# EasyEDA schematic 1-Schematic_PCIe riser to internal USB3.json

## Sheets
1 Sheet_2: TITLE: Sheet_2; REV: 1.0; Date: 2020-04-07; Sheet: 1/1; Drawn By: lfdla; Company: Your Company
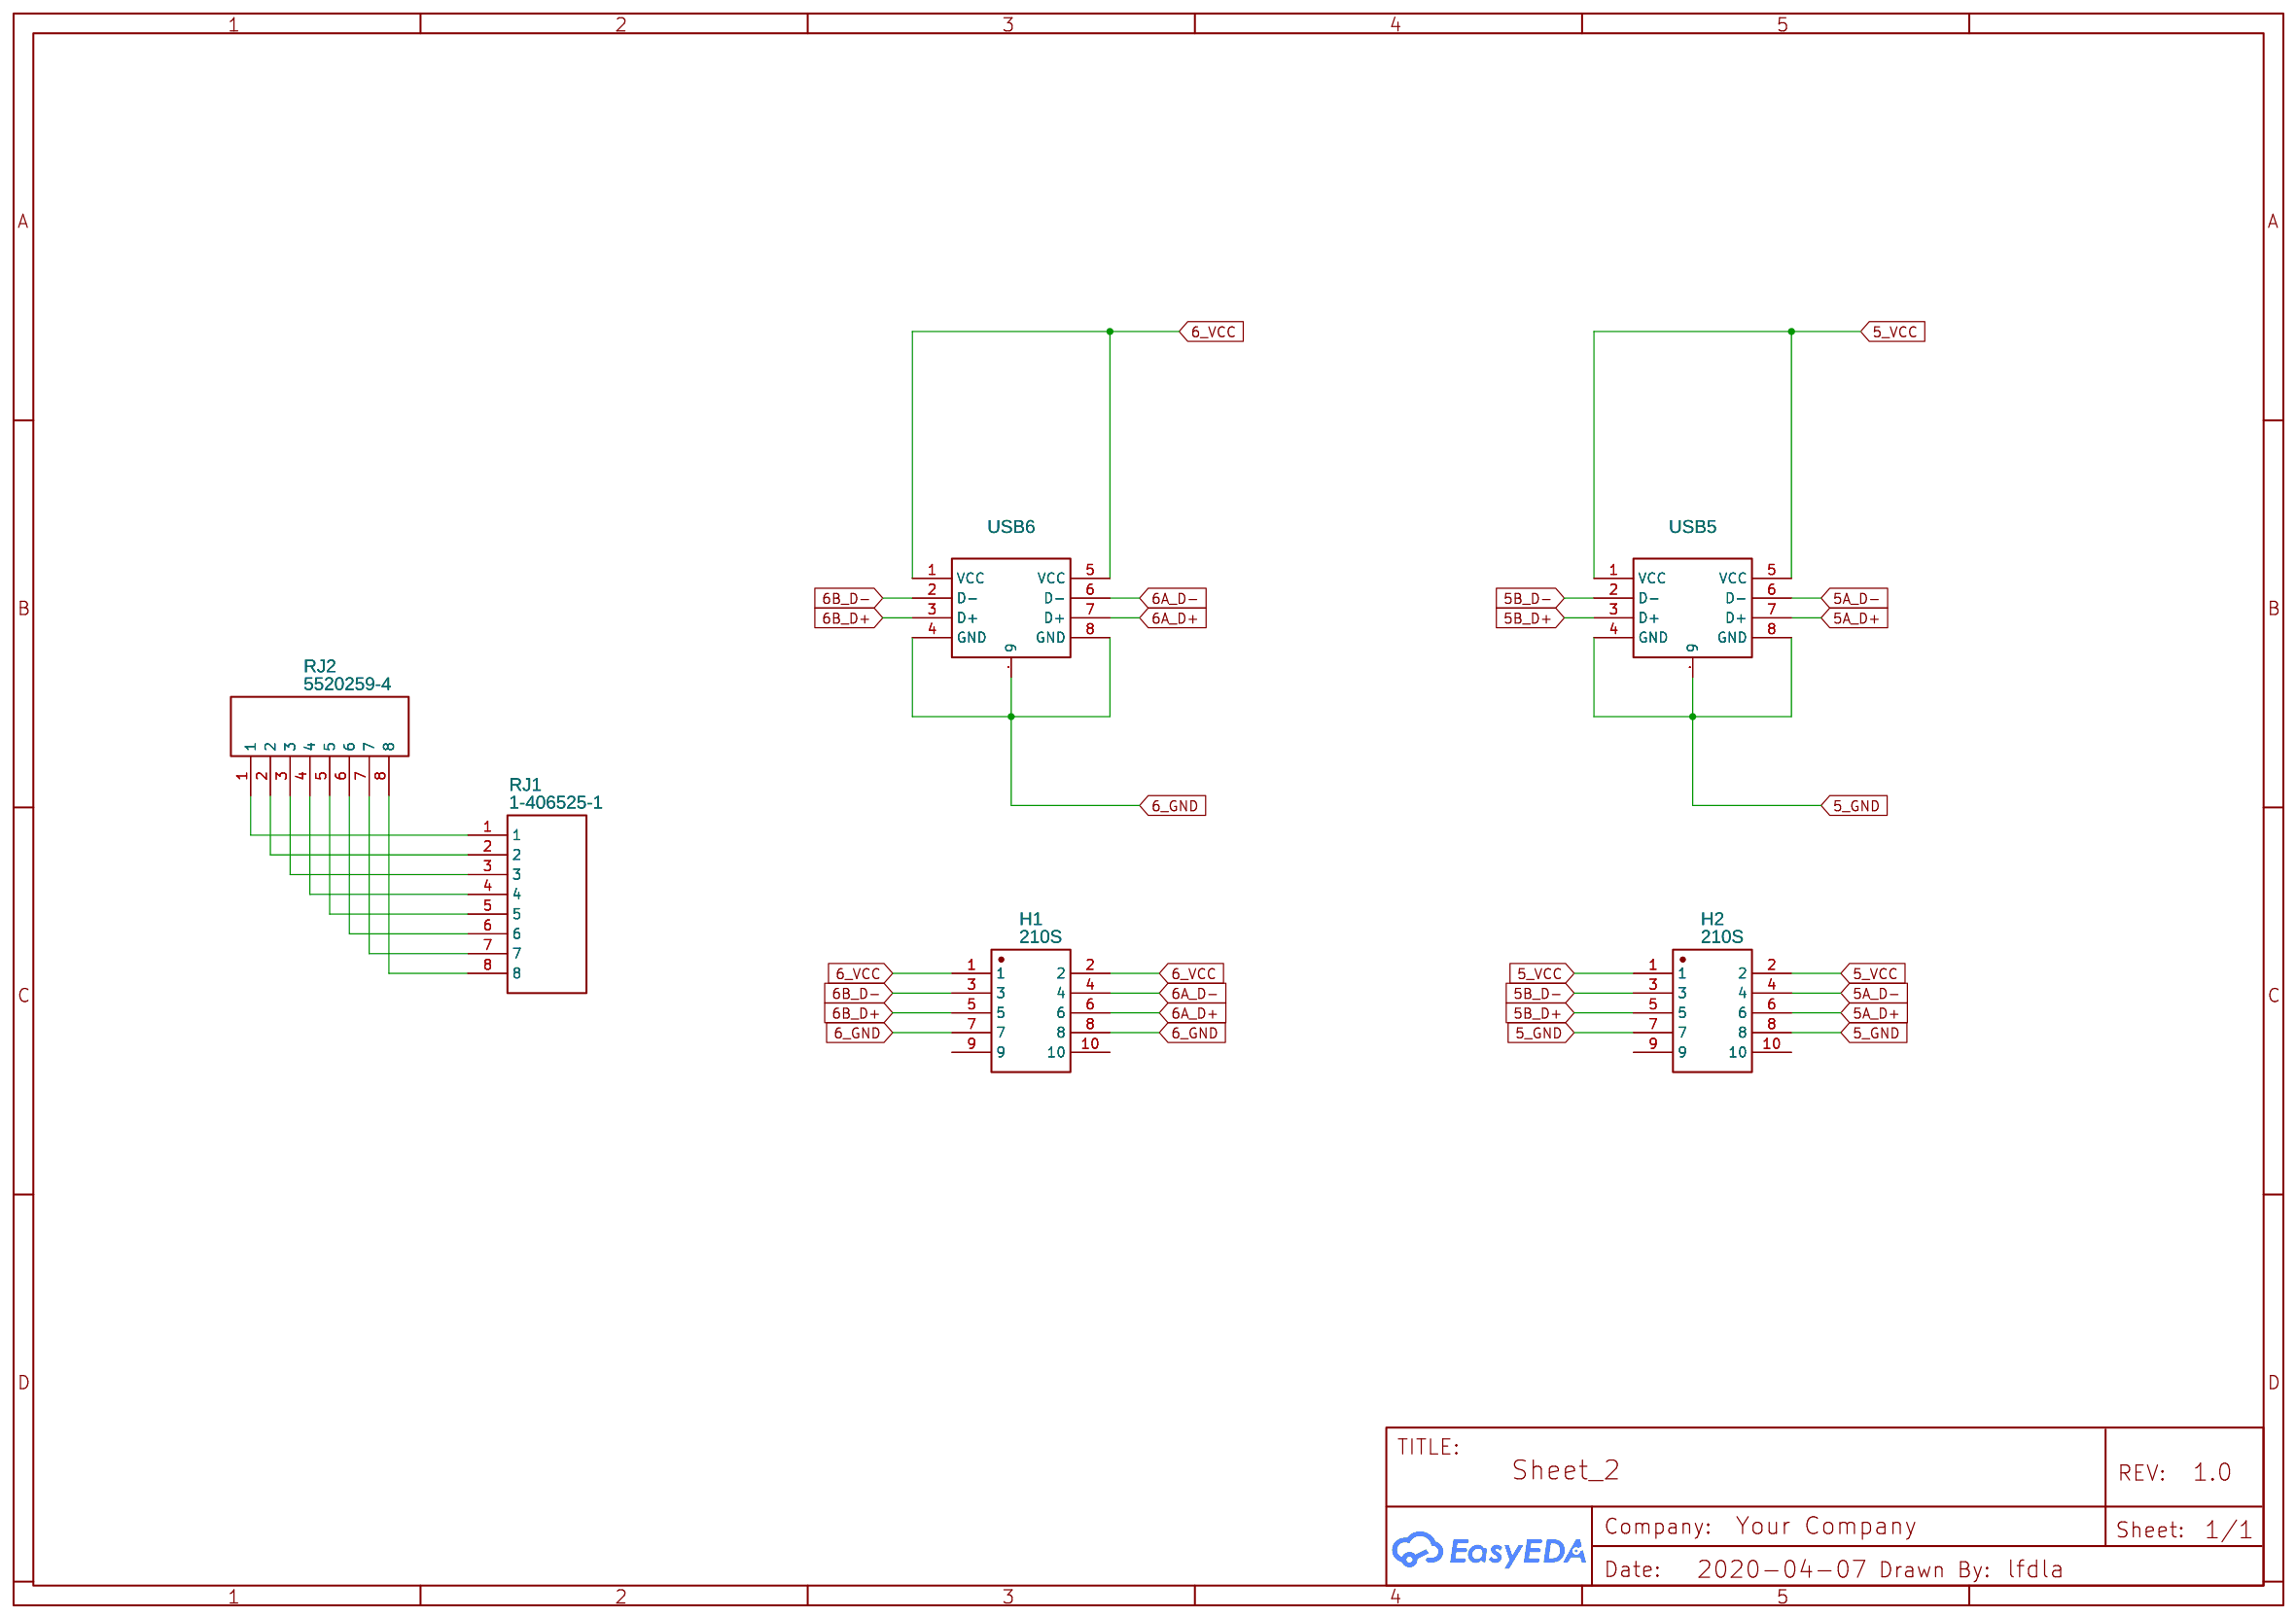
[diagram p0: Sheet_2]
2 Sheet_1: TITLE: Sheet_1; Date: 2020-04-05
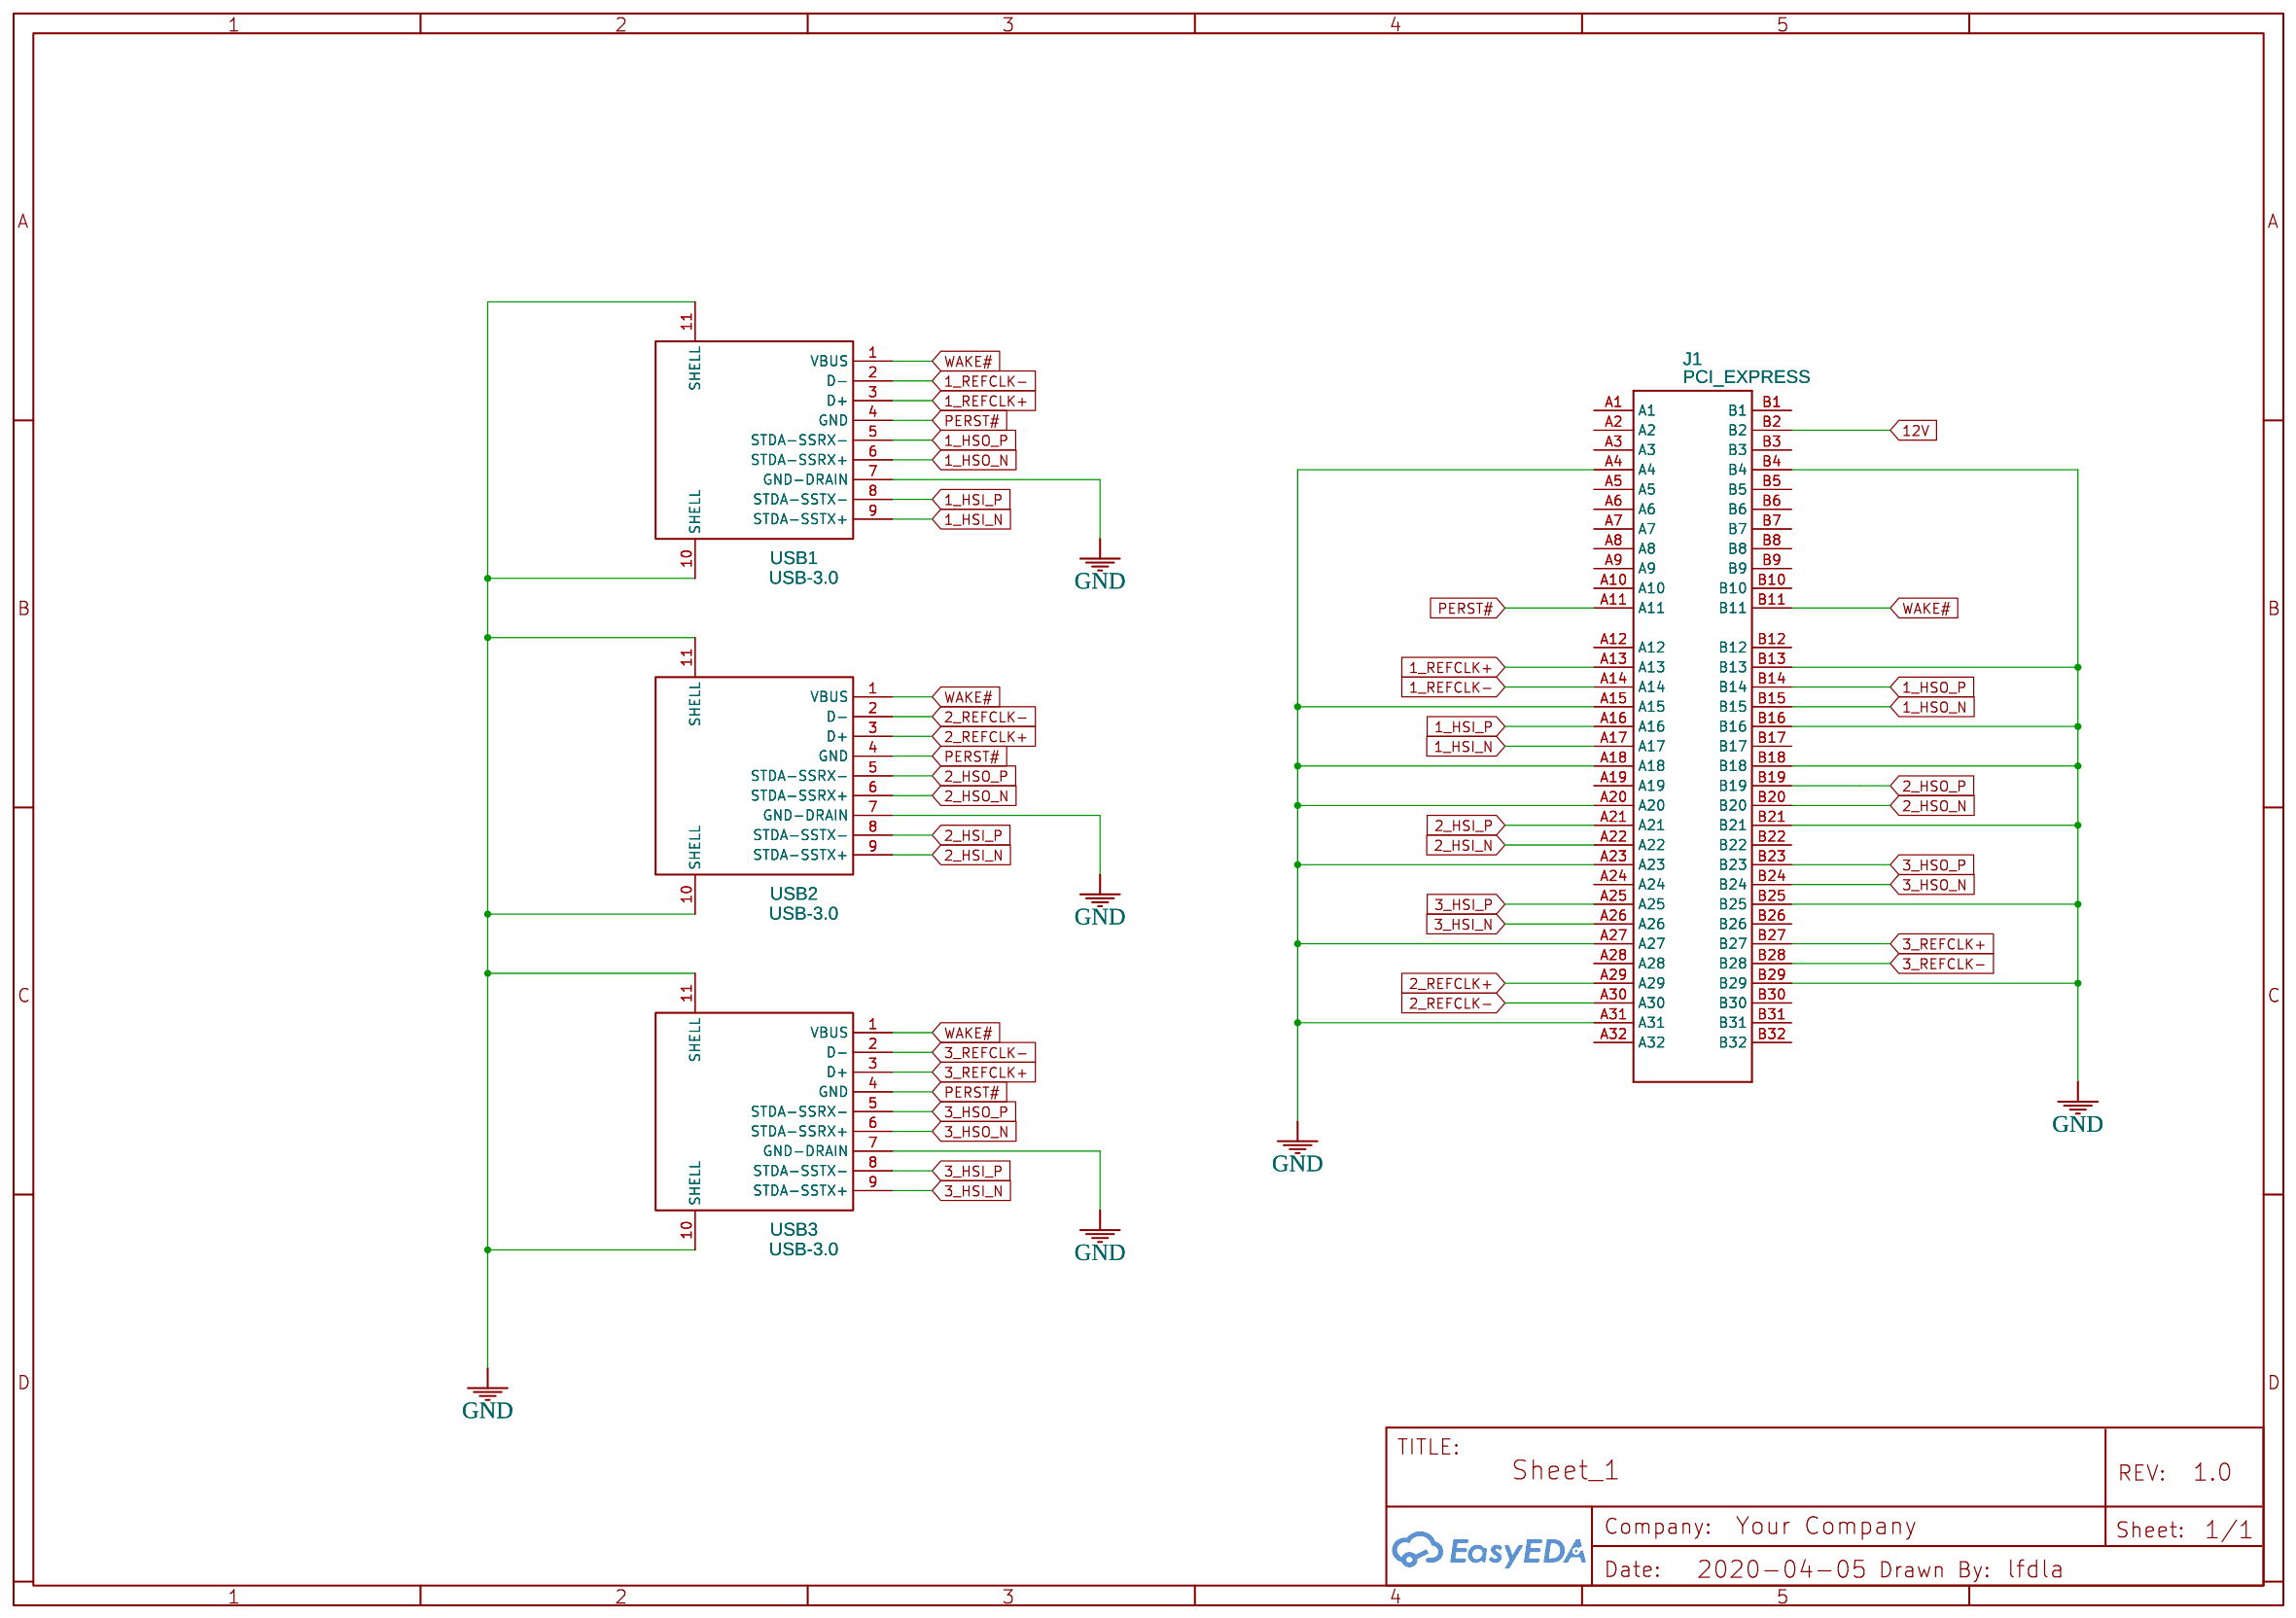
[diagram p1: Sheet_1]

## Parts
sheet Sheet_1
J1  PCI_EXPRESS  [PCIEX4]
USB1  USB-3.0  [USB-3.0-TH_C69073]
USB2  USB-3.0  [USB-3.0-TH_C69073]
USB3  USB-3.0  [USB-3.0-TH_C69073]
sheet Sheet_2
H1  210S  [HDR-TH_10P-P2.54-V-R2-C5-S2.54_MTP125-1205S1]
H2  210S  [HDR-TH_10P-P2.54-V-R2-C5-S2.54_MTP125-1205S1]
RJ1  1-406525-1  [RJ45-TH_1-406525-1]
RJ2  5520259-4  [RJ45-TH_5520259-4]
USB5  Double layer DIP 90° white  [USB-A-TH_USB-M-51]
USB6  Double layer DIP 90° white  [USB-A-TH_USB-M-51]

## Library data of the parts
J1 = PCI_EXPRESS_32PIN_MALE_PCB: Manufacturer Part: PCI_EXPRESS_PCB; Supplier Part: undefined; Contributor: Eduardo Solis
USB1-USB3 = USB-3.0-AF-90-16.5X12.5-H6.95: Supplier: LCSC; Supplier Part: C69073; Manufacturer: LCSC; Contributor: LCSC
H1 H2 = 210S-2*5P L=11.6MMGold-plated black: Supplier: LCSC; Manufacturer: Ckmtw; Contributor: LCSC; Supplier Part: C124387
RJ1 = 1-406525-1: Supplier: LCSC; Supplier Part: C125066; Manufacturer: TE Connectivity; Contributor: LCSC
RJ2 = 5520259-4: Supplier: LCSC; Manufacturer: TE Connectivity; Supplier Part: C86491
USB5 USB6 = Double layer DIP 90° white: Supplier: LCSC; Manufacturer: ValuePro; Supplier Part: C2341

## Nets
12V: J1.B2
GND: J1.A4 J1.A15 J1.A18 J1.A20 J1.A23 J1.A27 J1.A31 J1.B4 J1.B13 J1.B16 J1.B18 J1.B21 J1.B25 J1.B29 USB1.7(GND-DRAIN) USB1.10(SHELL) USB1.11(SHELL) USB2.7(GND-DRAIN) USB2.10(SHELL) USB2.11(SHELL) USB3.7(GND-DRAIN) USB3.10(SHELL) USB3.11(SHELL)
1_HSI_N: J1.A17 USB1.9(STDA-SSTX+)
1_HSI_P: J1.A16 USB1.8(STDA-SSTX-)
1_HSO_N: J1.B15 USB1.6(STDA-SSRX+)
1_HSO_P: J1.B14 USB1.5(STDA-SSRX-)
1_REFCLK+: J1.A13 USB1.3(D+)
1_REFCLK-: J1.A14 USB1.2(D-)
2_HSI_N: J1.A22 USB2.9(STDA-SSTX+)
2_HSI_P: J1.A21 USB2.8(STDA-SSTX-)
2_HSO_N: J1.B20 USB2.6(STDA-SSRX+)
2_HSO_P: J1.B19 USB2.5(STDA-SSRX-)
2_REFCLK+: J1.A29 USB2.3(D+)
2_REFCLK-: J1.A30 USB2.2(D-)
3_HSI_N: J1.A26 USB3.9(STDA-SSTX+)
3_HSI_P: J1.A25 USB3.8(STDA-SSTX-)
3_HSO_N: J1.B24 USB3.6(STDA-SSRX+)
3_HSO_P: J1.B23 USB3.5(STDA-SSRX-)
3_REFCLK+: J1.B27 USB3.3(D+)
3_REFCLK-: J1.B28 USB3.2(D-)
5_GND: H2.7 H2.8 USB5.4(GND) USB5.8(GND) USB5.9
5_VCC: H2.1 H2.2 USB5.1(VCC) USB5.5(VCC)
5A_D+: H2.6 USB5.7(D+)
5A_D-: H2.4 USB5.6(D-)
5B_D+: H2.5 USB5.3(D+)
5B_D-: H2.3 USB5.2(D-)
6_GND: H1.7 H1.8 USB6.4(GND) USB6.8(GND) USB6.9
6_VCC: H1.1 H1.2 USB6.1(VCC) USB6.5(VCC)
6A_D+: H1.6 USB6.7(D+)
6A_D-: H1.4 USB6.6(D-)
6B_D+: H1.5 USB6.3(D+)
6B_D-: H1.3 USB6.2(D-)
PERST#: J1.A11 USB1.4(GND) USB2.4(GND) USB3.4(GND)
WAKE#: J1.B11 USB1.1(VBUS) USB2.1(VBUS) USB3.1(VBUS)
Net-(RJ1-1): RJ1.1 RJ2.1
Net-(RJ1-2): RJ1.2 RJ2.2
Net-(RJ1-3): RJ1.3 RJ2.3
Net-(RJ1-4): RJ1.4 RJ2.4
Net-(RJ1-5): RJ1.5 RJ2.5
Net-(RJ1-6): RJ1.6 RJ2.6
Net-(RJ1-7): RJ1.7 RJ2.7
Net-(RJ1-8): RJ1.8 RJ2.8

Not connected (* = marked no-connect by the designer): H1 9 10; H2 9 10; J1 A1 A2 A3 A5 A6 A7 A8 A9 A10 A12 A19 A24 A28 A32 B1 B3 B5 B6 B7 B8 B9 B10 B12 B17 B22 B26 B30 B31 B32
